# EAGLE design Teensylu2-0.6 (EAGLE 7.1.0)
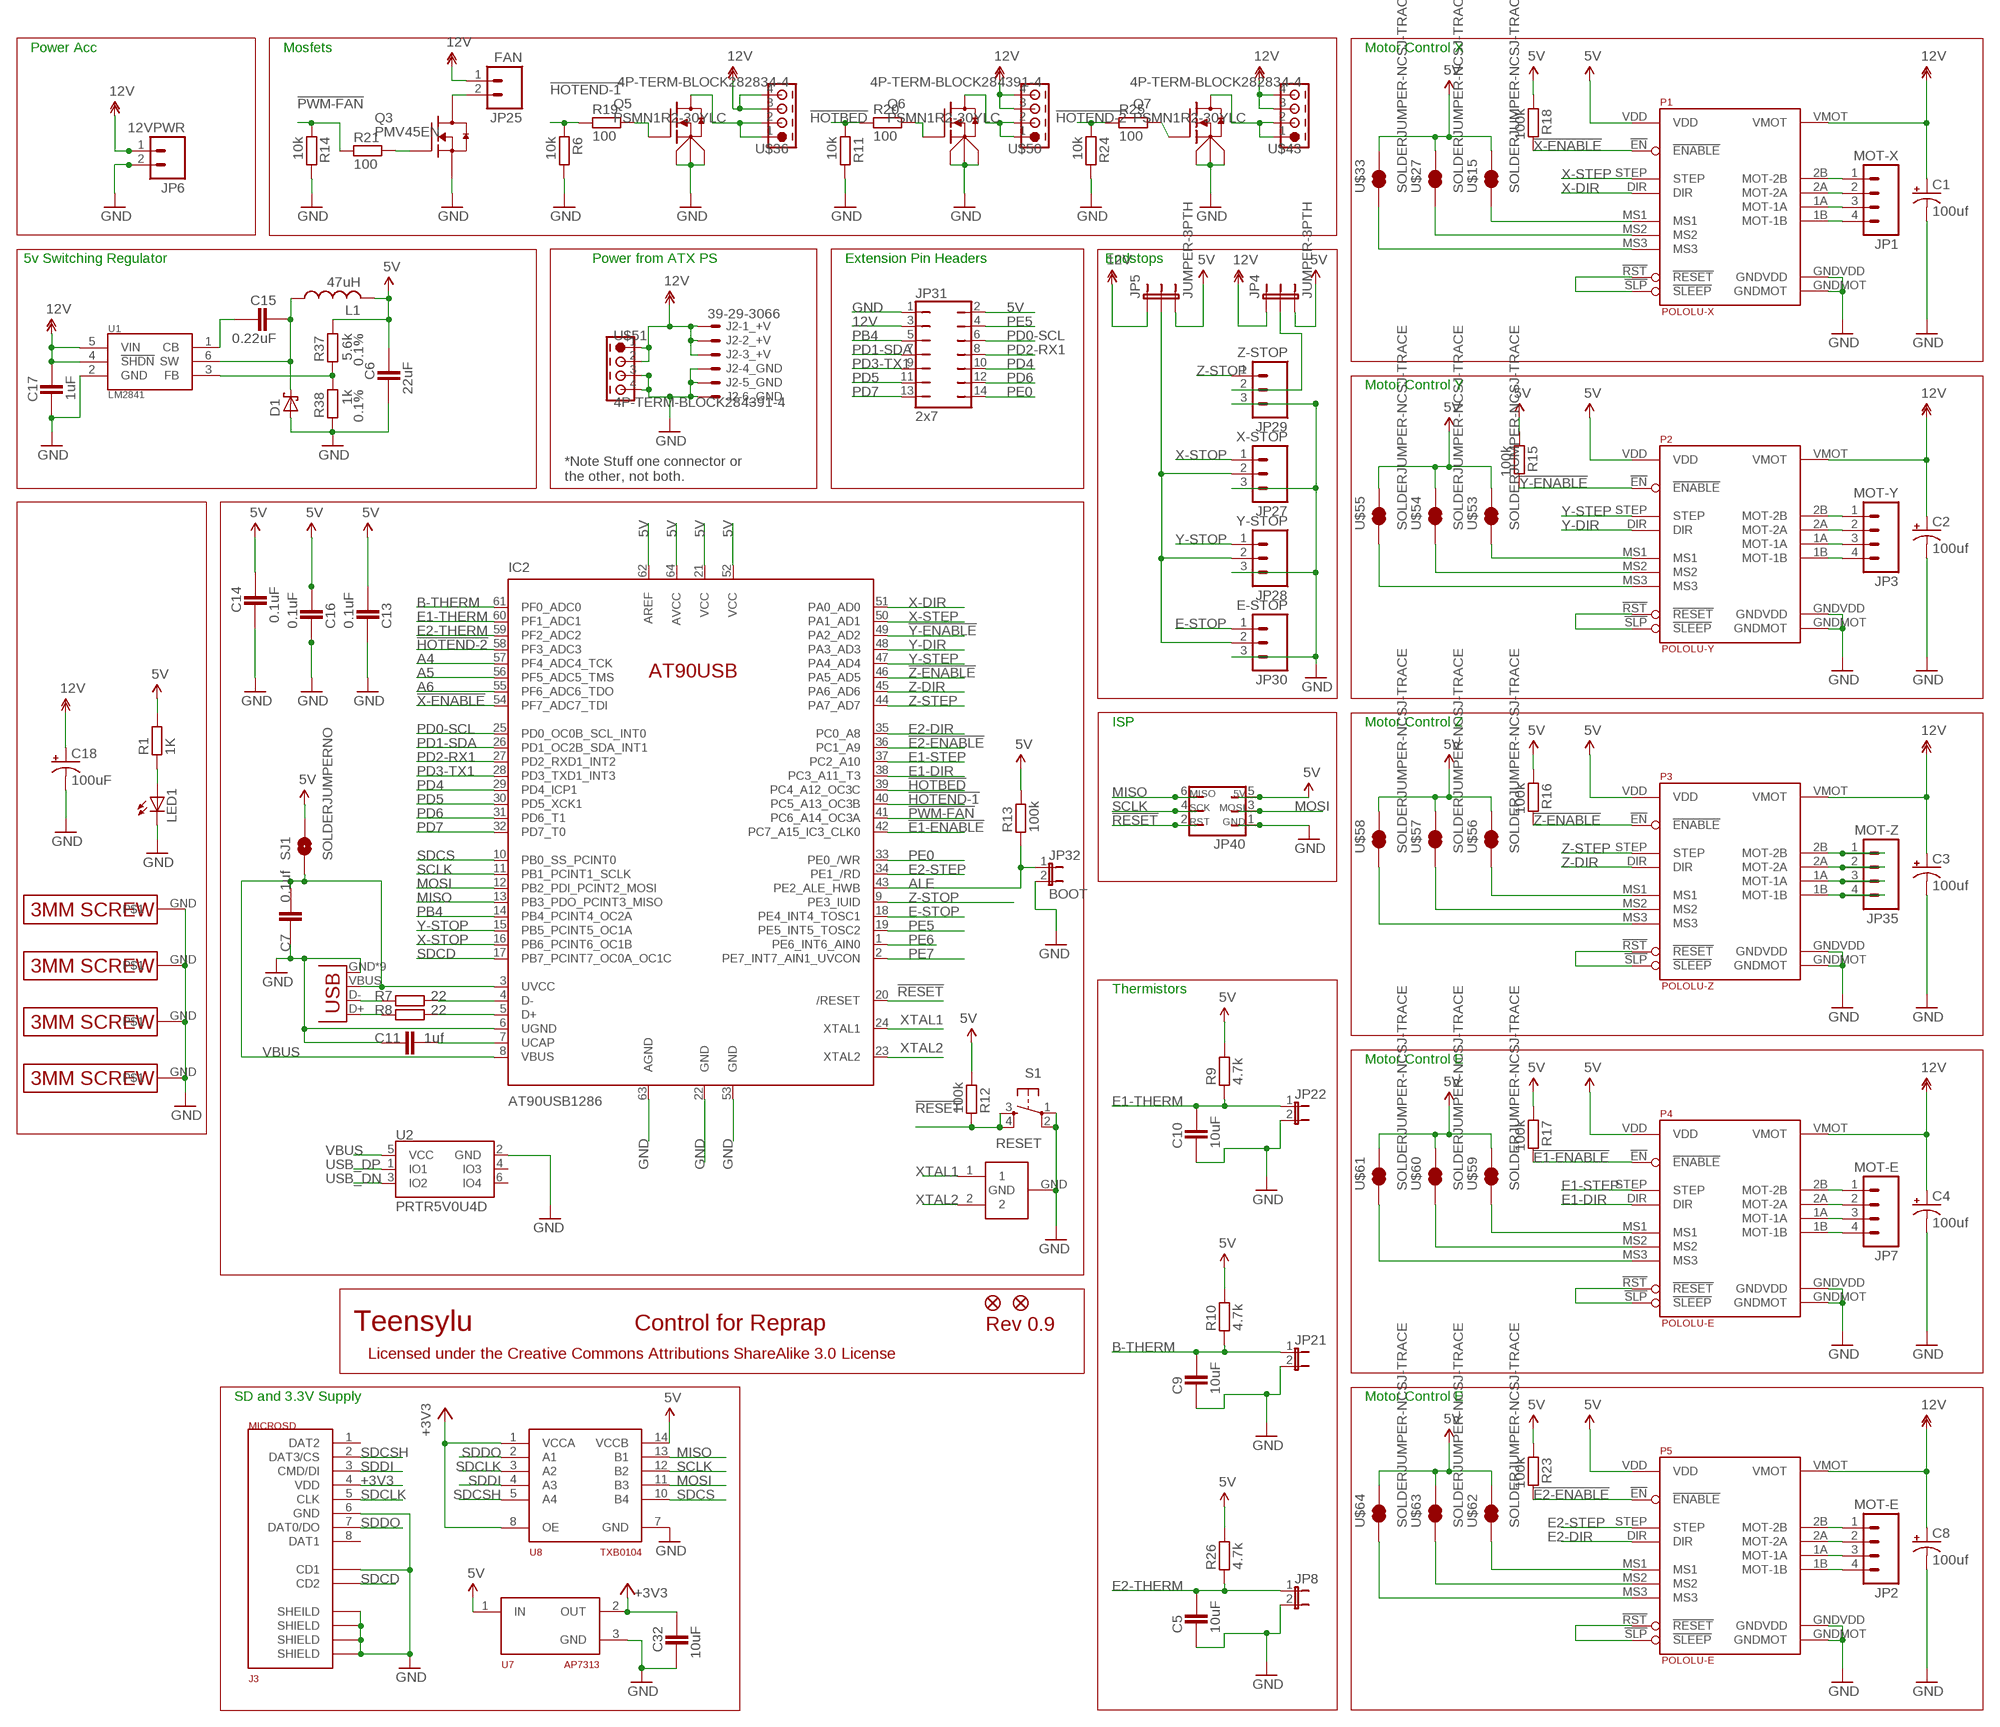
[diagram p0: schematic, sheet 1]

## Parts
C1  100uf  CAP_POLPTH1  [CPOL-RADIAL-100UF-25V]
C2  100uf  CAP_POLPTH1  [CPOL-RADIAL-100UF-25V]
C3  100uf  CAP_POLPTH1  [CPOL-RADIAL-100UF-25V]
C4  100uf  CAP_POLPTH1  [CPOL-RADIAL-100UF-25V]
C5  10uF  CAPACITOR_0603  [CAPC1608X92N]
C6  22uF  CAPACITOR_0805  [CAPC2012X145AN]
C7  0.1uf  CAPACITOR_0603  [CAPC1608X92N]
C8  100uf  CAP_POLPTH1  [CPOL-RADIAL-100UF-25V]
C9  10uF  CAPACITOR_0603  [CAPC1608X92N]
C10  10uF  CAPACITOR_0603  [CAPC1608X92N]
C11  1uf  CAPACITOR_0603  [CAPC1608X92N]
C13  0.1uF  CAPACITOR_0603  [CAPC1608X92N]
C14  0.1uF  CAPACITOR_0603  [CAPC1608X92N]
C15  0.22uF  CAPACITOR_0603  [CAPC1608X92N]
C16  0.1uF  CAPACITOR_0603  [CAPC1608X92N]
C17  1uF  CAPACITOR_0805  [CAPC2012X145AN]
C18  100uF  CPOL-USD  [PANASONIC_D]
C32  10uF  CAPACITOR_0805  [CAPC2012X145AN]
D1  SCH-DIODESMA  [SMA]
IC2  AT90USB1286  AT90USB  [TQFP64-2]
J1  USB-MICRO-PTH  [USB-MICROB-PTH]
J2  39-29-3066  [39-29-3066]
J3  MICROSD  [AMPHENOL-MICROSD]
JP1  MOT-X  M04POLAR  [MOLEX-1X4]
JP2  MOT-E  M04POLAR  [MOLEX-1X4]
JP3  MOT-Y  M04POLAR  [MOLEX-1X4]
JP4  JUMPER-3PTH  [1X03]
JP5  JUMPER-3PTH  [1X03]
JP6  12VPWR  M02POLAR  [MOLEX-1X2]
JP7  MOT-E  M04POLAR  [MOLEX-1X4]
JP8  JUMPER-2PTH  [1X02]
JP21  JUMPER-2PTH  [1X02]
JP22  JUMPER-2PTH  [1X02]
JP25  FAN  M02POLAR  [MOLEX-1X2]
JP26  FIDUCIAL1X2.5  [FIDUCIAL-1X2.5]
JP27  X-STOP  M03POLAR  [MOLEX-1X3]
JP28  Y-STOP  M03POLAR  [MOLEX-1X3]
JP29  Z-STOP  M03POLAR  [MOLEX-1X3]
JP30  E-STOP  M03POLAR  [MOLEX-1X3]
JP31  2x7  JP7Q  [JP7Q]
JP32  BOOT  JUMPER-2PTH  [1X02]
JP33  FIDUCIAL1X2.5  [FIDUCIAL-1X2.5]
JP35  MOT-Z  M04POLAR  [MOLEX-1X4]
JP40  PROGHEADER  [ISP]
L1  47uH  L-US  [SDR1006]
LED1  LEDCHIPLED_0805  [CHIPLED_0805]
P1  POLOLU-X  POLOLU-ALLEGRO  [POLOLU-STEPPER-PTH]
P2  POLOLU-Y  POLOLU-ALLEGRO  [POLOLU-STEPPER-PTH]
P3  POLOLU-Z  POLOLU-ALLEGRO  [POLOLU-STEPPER-PTH]
P4  POLOLU-E  POLOLU-ALLEGRO  [POLOLU-STEPPER-PTH]
P5  POLOLU-E  POLOLU-ALLEGRO  [POLOLU-STEPPER-PTH]
Q3  PMV45EN  MOSFET-NCH_SOT-23  [SOT95P280X135-3N]
Q5  PSMN1R2-30YLC  [LFPACK-POWERPAK-SO8]
Q6  PSMN1R2-30YLC  [LFPACK-POWERPAK-SO8]
Q7  PSMN1R2-30YLC  [LFPACK-POWERPAK-SO8]
R1  1K  RESISTOR_0603  [RESC1608X55N]
R6  10k  RESISTOR_0603  [RESC1608X55N]
R7  22  RESISTOR_0603  [RESC1608X55N]
R8  22  RESISTOR_0603  [RESC1608X55N]
R9  4.7k  RESISTOR_0603  [RESC1608X55N]
R10  4.7k  RESISTOR_0603  [RESC1608X55N]
R11  10k  RESISTOR_0603  [RESC1608X55N]
R12  100k  RESISTOR_0603  [RESC1608X55N]
R13  100k  RESISTOR_0603  [RESC1608X55N]
R14  10k  RESISTOR_0603  [RESC1608X55N]
R15  100k  RESISTOR_0603  [RESC1608X55N]
R16  100k  RESISTOR_0603  [RESC1608X55N]
R17  100k  RESISTOR_0603  [RESC1608X55N]
R18  100k  RESISTOR_0603  [RESC1608X55N]
R19  100  RESISTOR_0603  [RESC1608X55N]
R20  100  RESISTOR_0603  [RESC1608X55N]
R21  100  RESISTOR_0603  [RESC1608X55N]
R23  100k  RESISTOR_0603  [RESC1608X55N]
R24  10k  RESISTOR_0603  [RESC1608X55N]
R25  100  RESISTOR_0603  [RESC1608X55N]
R26  4.7k  RESISTOR_0603  [RESC1608X55N]
R37  5.6k  RESISTOR_0603  [RESC1608X55N]
R38  1k  RESISTOR_0603  [RESC1608X55N]
S1  RESET  TAC_SWITCHPTH  [TACTILE-PTH]
SJ1  SOLDERJUMPERNO  [SJ_2S-NO]
U1  LM2841  [TSOT6]
U2  PRTR5V0U4D  [SOT23-6]
U7  AP7313  [SOT23C]
U8  TXB0104  [TSSOP14]
U$15  SOLDERJUMPER-NCSJ-TRACE  [SJ_2S-TRACE]
U$17  3MM-SCREW  [PLATEDSCREW]
U$24  3MM-SCREW  [PLATEDSCREW]
U$27  SOLDERJUMPER-NCSJ-TRACE  [SJ_2S-TRACE]
U$33  SOLDERJUMPER-NCSJ-TRACE  [SJ_2S-TRACE]
U$34  3MM-SCREW  [PLATEDSCREW]
U$36  4P-TERM-BLOCK282834-4  [282834-4]
U$37  3MM-SCREW  [PLATEDSCREW]
U$43  4P-TERM-BLOCK282834-4  [282834-4]
U$50  4P-TERM-BLOCK284391-4  [284391-4]
U$51  4P-TERM-BLOCK284391-4  [284391-4]
U$53  SOLDERJUMPER-NCSJ-TRACE  [SJ_2S-TRACE]
U$54  SOLDERJUMPER-NCSJ-TRACE  [SJ_2S-TRACE]
U$55  SOLDERJUMPER-NCSJ-TRACE  [SJ_2S-TRACE]
U$56  SOLDERJUMPER-NCSJ-TRACE  [SJ_2S-TRACE]
U$57  SOLDERJUMPER-NCSJ-TRACE  [SJ_2S-TRACE]
U$58  SOLDERJUMPER-NCSJ-TRACE  [SJ_2S-TRACE]
U$59  SOLDERJUMPER-NCSJ-TRACE  [SJ_2S-TRACE]
U$60  SOLDERJUMPER-NCSJ-TRACE  [SJ_2S-TRACE]
U$61  SOLDERJUMPER-NCSJ-TRACE  [SJ_2S-TRACE]
U$62  SOLDERJUMPER-NCSJ-TRACE  [SJ_2S-TRACE]
U$63  SOLDERJUMPER-NCSJ-TRACE  [SJ_2S-TRACE]
U$64  SOLDERJUMPER-NCSJ-TRACE  [SJ_2S-TRACE]
XTAL  KYOCERA_PQRC_TYPE_S_RESONATOR  [AVX_3.2X1.3_RESONATOR]

## Nets
5V [power]: C6.1 C13.2 C14.1 C16.2 IC2.21(VCC) IC2.52(VCC) IC2.62(AREF) IC2.64(AVCC) JP4.3 JP5.3 JP31.2 JP40.5 L1.P$2 P1.VDD P2.VDD P3.VDD P4.VDD P5.VDD R1.2 R9.2 R10.2 R12.2 R13.2 R15.1 R16.1 R17.1 R18.1 R23.1 R26.2 R37.1 SJ1.2 U7.1(IN) U8.14(VCCB) U$15.2 U$27.2 U$33.2 U$53.2 U$54.2 U$55.2 U$56.2 U$57.2 U$58.2 U$59.2 U$60.2 U$61.2 U$62.2 U$63.2 U$64.2
5VREG_CB: C15.2 U1.1(CB)
5VREG_FB: R37.2 R38.1 U1.3(FB)
5VREG_SW: C15.1 D1.C L1.P$1 U1.6(SW)
12V: C1.1(+) C2.1(+) C3.1(+) C4.1(+) C8.1(+) C17.1 C18.+ J2.1 J2.2 J2.3 JP4.1 JP5.1 JP6.1 JP25.1 JP31.3 P1.VMOT P2.VMOT P3.VMOT P4.VMOT P5.VMOT U1.4(!SHDN) U1.5(VIN) U$36.3 U$36.4 U$43.3 U$43.4 U$50.3 U$50.4 U$51.1 U$51.2
!E1-ENABLE: IC2.42(PC7_A15_IC3_CLK0) P4.!EN(!ENABLE) R17.2
!E2-ENABLE: IC2.36(PC1_A9) P5.!EN(!ENABLE) R23.2
!HOTBED: IC2.39(PC4_A12_OC3C) R11.1 R20.1
!HOTEND-1: IC2.40(PC5_A13_OC3B) R6.1 R19.1
!HOTEND-2: IC2.58(PF3_ADC3) R24.1 R25.1
!PWM-FAN: IC2.41(PC6_A14_OC3A) R14.1 R21.1
!RESET: IC2.20(/RESET) JP40.2 R12.1 S1.3 S1.4
!X-ENABLE: IC2.54(PF7_ADC7_TDI) P1.!EN(!ENABLE) R18.2
!Y-ENABLE: IC2.49(PA2_AD2) P2.!EN(!ENABLE) R15.2
!Z-ENABLE: IC2.46(PA5_AD5) P3.!EN(!ENABLE) R16.2
+3V3 [power]: C32.1 J3.4(VDD) U7.2(OUT) U8.1(VCCA) U8.8(OE)
A4: IC2.57(PF4_ADC4_TCK)
A5: IC2.56(PF5_ADC5_TMS)
A6: IC2.55(PF6_ADC6_TDO)
ALE: IC2.43(PE2_ALE_HWB) JP32.1 R13.1
B-THERM: C9.2 IC2.61(PF0_ADC0) JP21.1 R10.1
E1-DIR: IC2.38(PC3_A11_T3) P4.DIR
E1-STEP: IC2.37(PC2_A10) P4.STEP
E1-THERM: C10.2 IC2.60(PF1_ADC1) JP22.1 R9.1
E2-DIR: IC2.35(PC0_A8) P5.DIR
E2-STEP: IC2.34(PE1_/RD) P5.STEP
E2-THERM: C5.2 IC2.59(PF2_ADC2) JP8.1 R26.1
E-MOT-1A [power]: JP7.3 P4.1A(MOT-1A)
E-MOT-1A1 [power]: JP2.3 P5.1A(MOT-1A)
E-MOT-1B [power]: JP7.4 P4.1B(MOT-1B)
E-MOT-1B1 [power]: JP2.4 P5.1B(MOT-1B)
E-MOT-2A [power]: JP7.2 P4.2A(MOT-2A)
E-MOT-2A1 [power]: JP2.2 P5.2A(MOT-2A)
E-MOT-2B [power]: JP7.1 P4.2B(MOT-2B)
E-MOT-2B1 [power]: JP2.1 P5.2B(MOT-2B)
E-MS1: P4.MS1 U$59.1
E-MS2: P4.MS2 U$60.1
E-MS3: P4.MS3 U$61.1
E-MS4: P5.MS1 U$62.1
E-MS5: P5.MS2 U$63.1
E-MS6: P5.MS3 U$64.1
E-RESETSLEEP: P4.!RST(!RESET) P4.!SLP(!SLEEP)
E-RESETSLEEP1: P5.!RST(!RESET) P5.!SLP(!SLEEP)
E-STOP: IC2.18(PE4_INT4_TOSC1) JP30.1
ENDSTOP+V: JP5.2 JP27.2 JP28.2 JP30.2
GND [power]: C1.2(-) C2.2(-) C3.2(-) C4.2(-) C5.1 C6.2 C7.1 C8.2(-) C9.1 C10.1 C11.1 C13.1 C14.2 C16.1 C17.2 C18.- C32.2 D1.A IC2.6(UGND) IC2.22(GND) IC2.53(GND) IC2.63(AGND) J1.GND J1.GND1(GND) J1.GND2(GND) J1.GND3(GND) J1.GND4(GND) J1.GND5(GND) J1.GND6(GND) J1.GND7(GND) J1.GND8(GND) J2.4 J2.5 J2.6 J3.6(GND) J3.C1(SHEILD) J3.C2(SHIELD) J3.C3(SHIELD) J3.C4(SHIELD) J3.CD1 JP6.2 JP8.2 JP21.2 JP22.2 JP27.3 JP28.3 JP29.3 JP30.3 JP31.1 JP32.2 JP40.1 LED1.C P1.GNDMOT P1.GNDVDD P2.GNDMOT P2.GNDVDD P3.GNDMOT P3.GNDVDD P4.GNDMOT P4.GNDVDD P5.GNDMOT P5.GNDVDD Q3.2(S) Q5.1(S1) Q5.2(S2) Q5.3(S3) Q6.1(S1) Q6.2(S2) Q6.3(S3) Q7.1(S1) Q7.2(S2) Q7.3(S3) R6.2 R11.2 R14.2 R24.2 R38.2 S1.1 S1.2 U1.2(GND) U2.2(GND) U7.3(GND) U8.7(GND) U$17.GND U$24.GND U$34.GND U$37.GND U$51.3 U$51.4 XTAL.GND
HOTBED-GND [power]: Q6.5-8(D) U$50.1 U$50.2
HOTEND-GND [power]: Q5.5-8(D) U$36.1 U$36.2
HOTEND-GND1 [power]: Q7.5-8(D) U$43.1 U$43.2
MISO: IC2.13(PB3_PDO_PCINT3_MISO) JP40.6 U8.13(B1)
MOSI: IC2.12(PB2_PDI_PCINT2_MOSI) JP40.3 U8.11(B3)
N$1: LED1.A R1.1
N$2: Q6.4(G) R20.2
N$3: IC2.4(D-) R7.2
N$4: IC2.5(D+) R8.2
N$6: JP25.2 Q3.3(D)
N$10: Q3.1(G) R21.2
N$11: Q5.4(G) R19.2
N$13: Q7.4(G) R25.2
PB4: IC2.14(PB4_PCINT4_OC2A) JP31.5
PD0-SCL: IC2.25(PD0_OC0B_SCL_INT0) JP31.6
PD1-SDA: IC2.26(PD1_OC2B_SDA_INT1) JP31.7
PD2-RX1: IC2.27(PD2_RXD1_INT2) JP31.8
PD3-TX1: IC2.28(PD3_TXD1_INT3) JP31.9
PD4: IC2.29(PD4_ICP1) JP31.10
PD5: IC2.30(PD5_XCK1) JP31.11
PD6: IC2.31(PD6_T1) JP31.12
PD7: IC2.32(PD7_T0) JP31.13
PE0: IC2.33(PE0_/WR) JP31.14
PE5: IC2.19(PE5_INT5_TOSC2) JP31.4
PE6: IC2.1(PE6_INT6_AIN0)
PE7: IC2.2(PE7_INT7_AIN1_UVCON)
SCLK: IC2.11(PB1_PCINT1_SCLK) JP40.4 U8.12(B2)
SDCD: IC2.17(PB7_PCINT7_OC0A_OC1C) J3.CD2
SDCLK: J3.5(CLK) U8.3(A2)
SDCS: IC2.10(PB0_SS_PCINT0) U8.10(B4)
SDCSH: J3.2(DAT3/CS) U8.5(A4)
SDDI: J3.3(CMD/DI) U8.4(A3)
SDDO: J3.7(DAT0/DO) U8.2(A1)
UCAP: C11.2 IC2.7(UCAP)
USB_DN: J1.D- R7.1 U2.3(IO2)
USB_DP: J1.D+ R8.1 U2.1(IO1)
VBUS: C7.2 IC2.3(UVCC) IC2.8(VBUS) J1.VBUS SJ1.1 U2.5(VCC)
X-DIR: IC2.51(PA0_AD0) P1.DIR
X-MOT-1A [power]: JP1.3 P1.1A(MOT-1A)
X-MOT-1B [power]: JP1.4 P1.1B(MOT-1B)
X-MOT-2A [power]: JP1.2 P1.2A(MOT-2A)
X-MOT-2B [power]: JP1.1 P1.2B(MOT-2B)
X-MS1: P1.MS1 U$15.1
X-MS2: P1.MS2 U$27.1
X-MS3: P1.MS3 U$33.1
X-RESETSLEEP: P1.!RST(!RESET) P1.!SLP(!SLEEP)
X-STEP: IC2.50(PA1_AD1) P1.STEP
X-STOP: IC2.16(PB6_PCINT6_OC1B) JP27.1
XTAL1: IC2.24(XTAL1) XTAL.1
XTAL2: IC2.23(XTAL2) XTAL.2
Y-DIR: IC2.48(PA3_AD3) P2.DIR
Y-MOT-1A [power]: JP3.3 P2.1A(MOT-1A)
Y-MOT-1B [power]: JP3.4 P2.1B(MOT-1B)
Y-MOT-2A [power]: JP3.2 P2.2A(MOT-2A)
Y-MOT-2B [power]: JP3.1 P2.2B(MOT-2B)
Y-MS1: P2.MS1 U$53.1
Y-MS2: P2.MS2 U$54.1
Y-MS3: P2.MS3 U$55.1
Y-RESETSLEEP: P2.!RST(!RESET) P2.!SLP(!SLEEP)
Y-STEP: IC2.47(PA4_AD4) P2.STEP
Y-STOP: IC2.15(PB5_PCINT5_OC1A) JP28.1
Z-DIR: IC2.45(PA6_AD6) P3.DIR
Z-MOT-1A [power]: JP35.3 P3.1A(MOT-1A)
Z-MOT-1B [power]: JP35.4 P3.1B(MOT-1B)
Z-MOT-2A [power]: JP35.2 P3.2A(MOT-2A)
Z-MOT-2B [power]: JP35.1 P3.2B(MOT-2B)
Z-MS1: P3.MS1 U$56.1
Z-MS2: P3.MS2 U$57.1
Z-MS3: P3.MS3 U$58.1
Z-RESETSLEEP: P3.!RST(!RESET) P3.!SLP(!SLEEP)
Z-STEP: IC2.44(PA7_AD7) P3.STEP
Z-STOP: IC2.9(PE3_IUID) JP29.1
Z-STOP-SUPPLY: JP4.2 JP29.2
Unconnected: J3.1(DAT2) J3.8(DAT1) U2.4(IO3) U2.6(IO4)

## Notes on the sheet
- Power Acc | Mosfets | Motor Control X
- 5v Switching Regulator | Power from ATX PS | Extension Pin Headers | Endstops
- Motor Control Y
- *Note Stuff one connector or
  the other, not both.
- ISP | Motor Control Z
- Thermistors
- Motor Control E
- Teensylu | Control for Reprap | Rev 0.9
- Licensed under the Creative Commons Attributions ShareAlike 3.0 License
- SD and 3.3V Supply | Motor Control E

## Library data of the parts
C1-C4 C8 = SparkFun:CAP_POL: Capacitor Polarized These are standard SMD and PTH capacitors. Normally 10uF, 47uF, and 100uF in electrolytic and tantalum varieties. Always verify the external diameter of the through hole cap, it varies with capacity, voltage, and manufacturer. The EIA devices should be standard.
C5-C7 C9-C11 C13-C17 C32 = ipc-7351-capacitor:CAPACITOR_
C18 = rcl:CPOL-US: POLARIZED CAPACITOR, American symbol
D1 = printrbot:SCH-DIODE: Schottky Diodes Source: Fairchild .. BAT54.pdf
IC2 = Atmel-at90usb-teensy:AT90USB
J1 = teensylu:USB: USB Connectors USB-B-PTH is fully proven SKU : PRT-00139 USB-miniB is fully proven SKU : PRT-00587 USB-A-PCB is untested. USB-A-H is throughly reviewed, but untested. Spark Fun Electronics SKU : PRT-00437 USB-B-SMT is throughly reviewed, but untested. Needs silkscreen touching up. USB-A-S has not been used/tested USB-MB-H has not been used/tested
J2 = teensylu:39-29-3066: Mini FIT connector 6 pol Without Snap-in peg Source: http://www.molex.com; MPN: 39-29-3066; OC_FARNELL: unknown; OC_NEWARK: 22K8620
J3 = teensylu:MICROSD
JP1-JP3 JP7 JP35 = SparkFun:M04: Header 4 Standard 4-pin 0.1" header. Use with straight break away headers (SKU : PRT-00116), right angle break away headers (PRT-00553), swiss pins (PRT-00743), machine pins (PRT-00117), and female headers (PRT-00115). Molex polarized connector foot print use with SKU : PRT-08231 with associated crimp pins and housings. 1MM SMD Version SKU: PRT-10208
JP4 JP5 = teensylu:JUMPER-3
JP6 JP25 = SparkFun:M02: Header 2 Standard 2-pin 0.1" header. Use with straight break away headers (SKU : PRT-00116), right angle break away headers (PRT-00553), swiss pins (PRT-00743), machine pins (PRT-00117), and female headers (PRT-00115). Molex polarized connector foot print use with SKU : PRT-08233 with associated crimp pins and housings.
JP8 JP21 JP22 JP32 = teensylu:JUMPER-2: Jumper Basic 0.1" spaced jumper. Use with breakaway headers.
JP26 JP33 = SparkFun:FIDUCIAL: Fiducial Alignment Points Various fiducial points for machine vision alignment.
JP27-JP30 = SparkFun:M03: Header 3 Standard 3-pin 0.1" header. Use with straight break away headers (SKU : PRT-00116), right angle break away headers (PRT-00553), swiss pins (PRT-00743), machine pins (PRT-00117), and female headers (PRT-00115). Molex polarized connector foot print use with SKU : PRT-08232 with associated crimp pins and housings.
JP31 = teensylu:JP7Q: JUMPER
JP40 = teensylu:PROGHEADER: JUMPER
L1 = teensylu:L-US
LED1 = led:LED: LED OSRAM: - CHIPLED LG R971, LG N971, LY N971, LG Q971, LY Q971, LO R971, LY R971 LH N974, LH R974 LS Q976, LO Q976, LY Q976 LO Q996 - Hyper CHIPLED LW Q18S LB Q993, LB Q99A, LB R99A - SideLED LS A670, LO A670, LY A670, LG A670, LP A670 LB A673, LV A673, LT A673, LW A673 LH A674 LY A675 LS A676, LA A676, LO A676, LY A676, LW A676 LS A679, LY A679, LG A679 - Hyper Micro SIDELED® LS Y876, LA Y876, LO Y876, LY Y876 LT Y87S - SmartLED LW L88C, LW L88S LB L89C, LB L89S, LG L890 LS L89K, LO L89K, LY L89K LS L896, LA L896, LO L896, LY L896 - TOPLED LS T670, LO T670, LY T670, LG T670, LP T670 LSG T670, LSP T670, LSY T670, LOP T670, LYG T670 LG T671, LOG T671, LSG T671 LB T673, LV T673, LT T673, LW T673 LH T674 LS T676, LA T676, LO T676, LY T676, LB T676, LH T676, LSB T676, LW T676 LB T67C, LV T67C, LT T67C, LS T67K, LO T67K, LY T67K, LW E67C LS E67B, LA E67B, LO E67B, LY E67B, LB E67C, LV E67C, LT E67C LW T67C LS T679, LY T679, LG T679 LS T770, LO T770, LY T770, LG T770, LP T770 LB T773, LV T773, LT T773, LW T773 LH T774 LS E675, LA E675, LY E675, LS T675 LS T776, LA T776, LO T776, LY T776, LB T776 LHGB T686 LT T68C, LB T68C - Hyper Mini TOPLED® LB M676 - Mini TOPLED Santana® LG M470 LS M47K, LO M47K, LY M47K Source: http://www.osram.convergy.de LUXEON: - LUMILED® LXK2-PW12-R00, LXK2-PW12-S00, LXK2-PW14-U00, LXK2-PW14-V00 LXK2-PM12-R00, LXK2-PM12-S00, LXK2-PM14-U00 LXK2-PE12-Q00, LXK2-PE12-R00, LXK2-PE12-S00, LXK2-PE14-T00, LXK2-PE14-U00 LXK2-PB12-K00, LXK2-PB12-L00, LXK2-PB12-M00, LXK2-PB14-N00, LXK2-PB14-P00, LXK2-PB14-Q00 LXK2-PR12-L00, LXK2-PR12-M00, LXK2-PR14-Q00, LXK2-PR14-R00 LXK2-PD12-Q00, LXK2-PD12-R00, LXK2-PD12-S00 LXK2-PH12-R00, LXK2-PH12-S00 LXK2-PL12-P00, LXK2-PL12-Q00, LXK2-PL12-R00 Source: www.luxeon.com KINGBRIGHT: KA-3528ASYC Source: www.kingbright.com
P1-P5 = teensylu:POLOLU-ALLEGRO
Q3 = ipc-7351-transistor:MOSFET-NCH_
Q5-Q7 = teensylu:PSMN1R2-30YLC: N-Channel MOSFET - 30V 100A LFPAK
R1 R6-R21 R23-R26 = ipc-7351-resistor:RESISTOR_
R37 R38 = ipc-7351-resistor:RESISTOR_; TOLERANCE: 0.1%
S1 = SparkFun:TAC_SWITCH: Momentary Switch Button commonly used for reset or general input. Spark Fun Electronics SKU : COM-00097
SJ1 = teensylu:SOLDERJUMPER: Solder Jumper Standard SMD solder jumper. Used to automate production. Two varients : Normally Open and Normally Closed are the same, but have different paste layers. NC will have a large amount of paste and should jumper during reflow.
U1 = teensylu:LM2841
U2 = teensylu:PRTR5V0U4D: NXP Semiconductors PRTR5V0U4D,125
U7 = teensylu:AP7313
U8 = teensylu:TXB0104
U$15 U$27 U$33 U$53-U$64 = teensylu:SOLDERJUMPER-NC
U$17 U$24 U$34 U$37 = teensylu:3MM-SCREW: 3mm Plated Through Hole Screw
U$36 U$43 U$50 U$51 = teensylu:4P-TERM-BLOCK
XTAL = Kyocera_Resonator:KYOCERA_PQRC_TYPE_S_RESONATOR

## Board
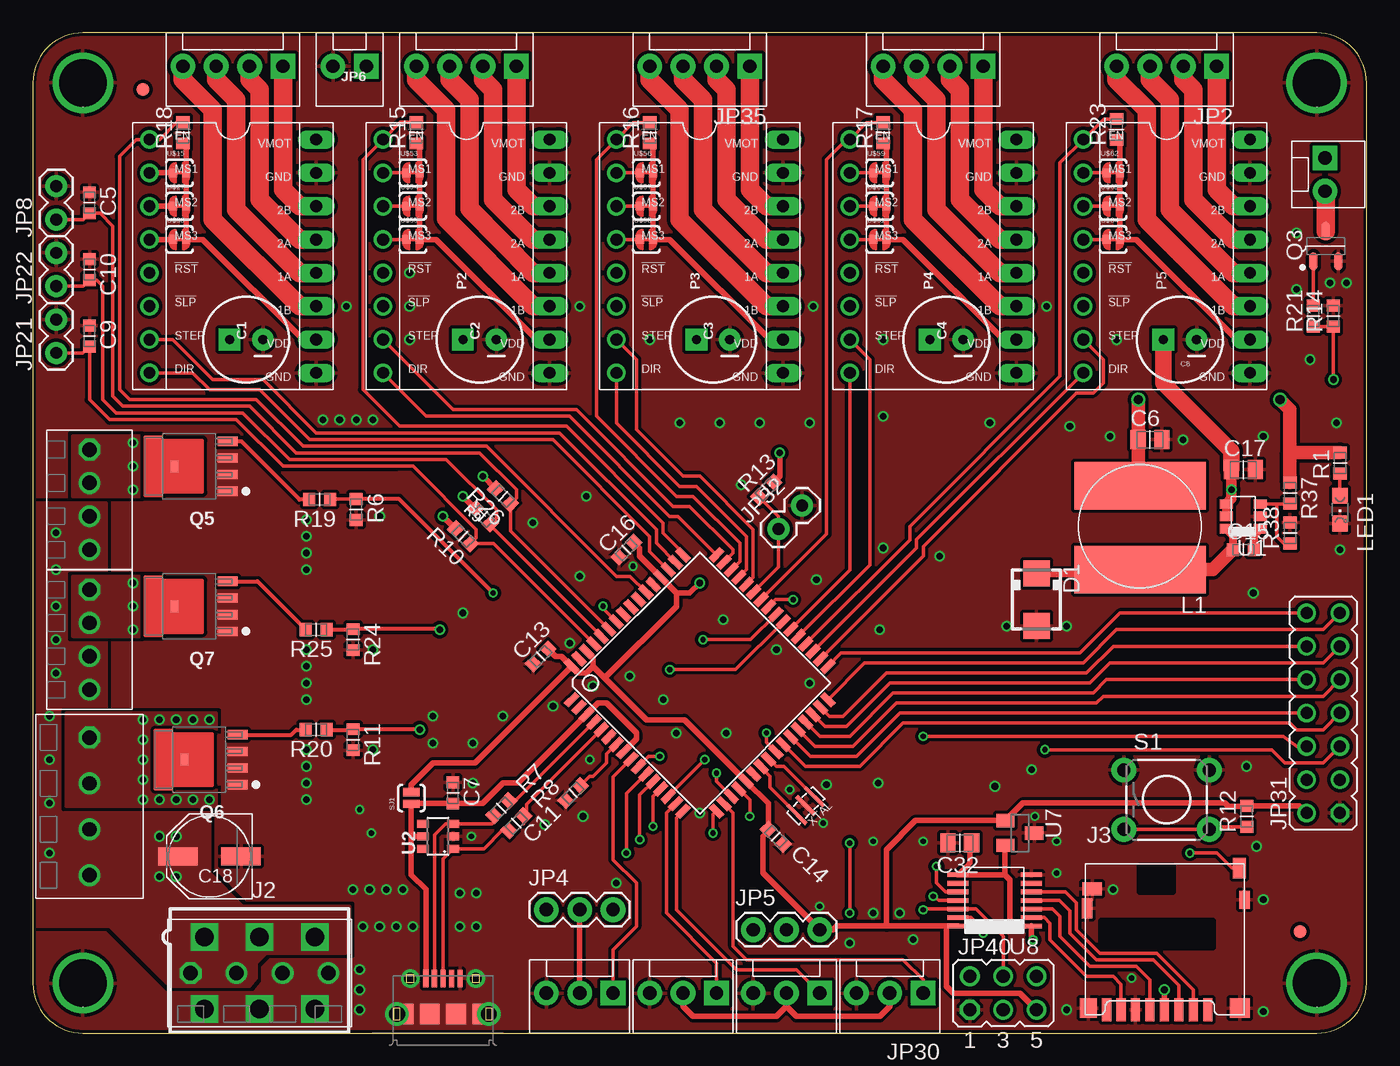
[diagram p1: board, top side]
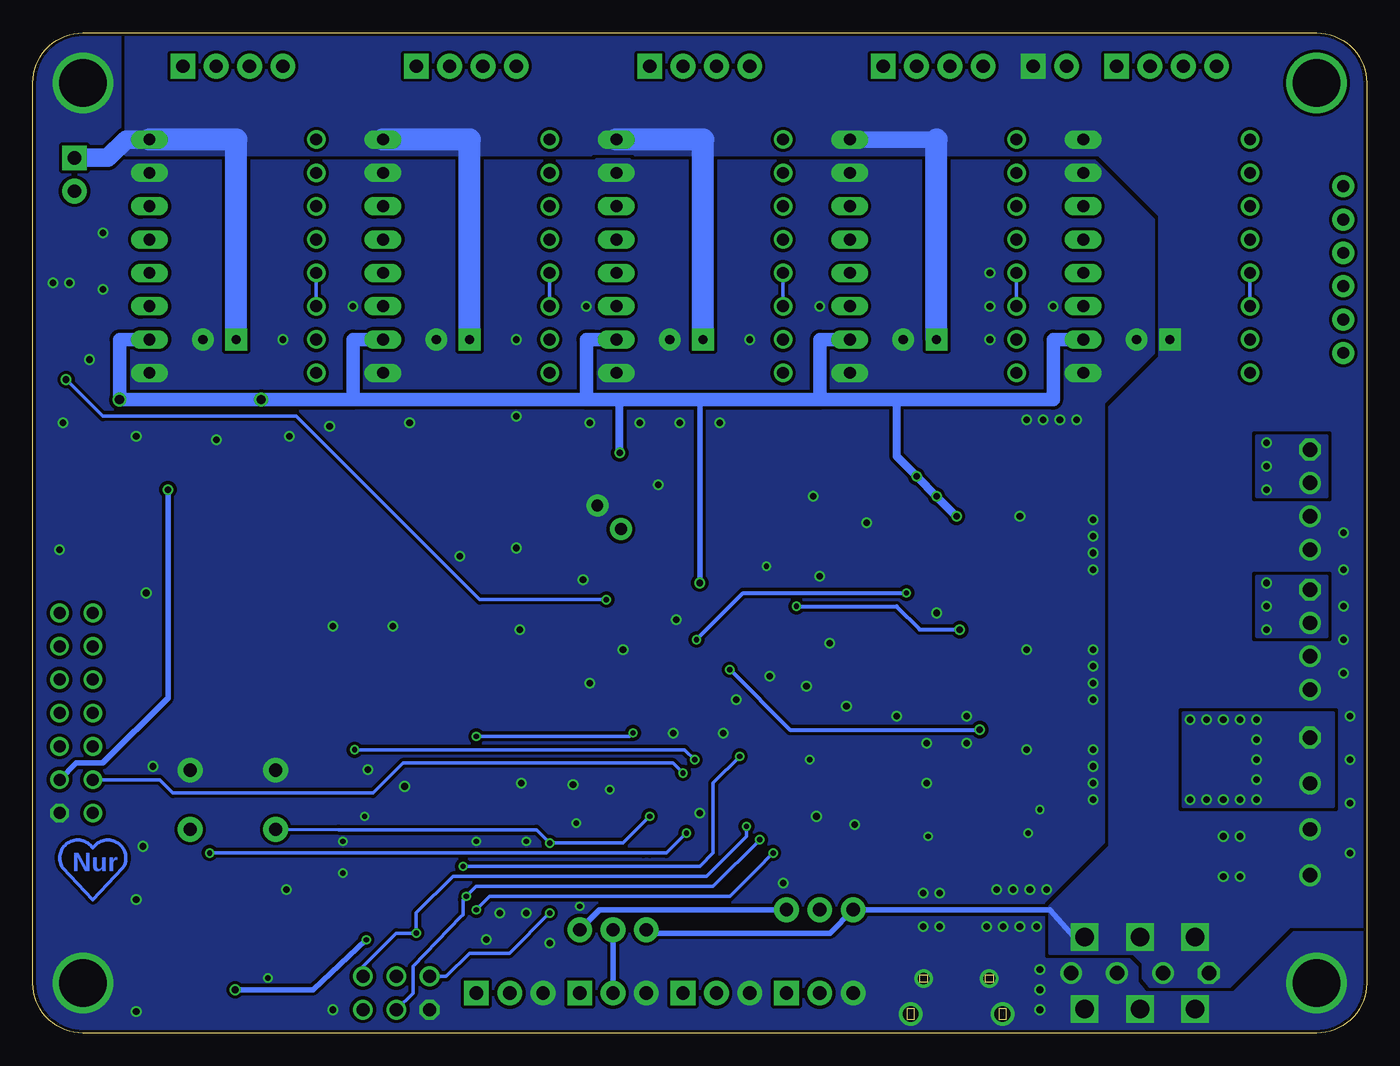
[diagram p2: board, bottom side, seen from below]

Size 101.6 x 76.2 mm. Coordinates in mm from the lower left corner, seen from the top.
Outline: 0,3.81 arc90 3.81,0 97.79,0 arc90 101.6,3.81 101.6,72.39 arc90 97.79,76.2 3.81,76.2 arc90 0,72.39 0,3.81
Copper layers (1*16): Top 0.035mm / dielectric 1.5mm / Bottom 0.035mm
Design rules "Teensylu Custom *": minimum track width 10mil, minimum drill 15mil, track to track 9mil, track to pad 9mil, pad to pad 9mil, via to via 9mil, smd to smd 0mil, copper to edge 10mil, drill to drill 10mil, minimum pad ring 10mil, minimum via ring 6mil, stop-mask expansion 2mil, vias tented up to drill 100mil, thermal gap 10mil

### Footprints (pad centres in the part's own frame; a part is rotated, then mirrored left to right if it is on the bottom)
CPOL-RADIAL-100UF-25V = drill 0.7 pad 1.651 square: 1 1.27,0 | drill 0.7 pad 1.651: 2 -1.27,0
CAPC1608X92N = smd 0.9 x 0.95: 1 -0.8,0; 2 0.8,0
CAPC2012X145AN = smd 1.15 x 1.45: 1 -0.9,0; 2 0.9,0
PANASONIC_D = smd 3 x 1.4: + 2.4,0; - -2.4,0
SMA = smd 2 x 2: A 2,0; C -2,0
TQFP64-2 = smd 1.194 x 0.508: 1 -7.8,6; 2 -7.8,5.2; 3 -7.8,4.4; 4 -7.8,3.6; 5 -7.8,2.8; 6 -7.8,2; 7 -7.8,1.2; 8 -7.8,0.4; 9 -7.8,-0.4; 10 -7.8,-1.2; 11 -7.8,-2; 12 -7.8,-2.8; 13 -7.8,-3.6; 14 -7.8,-4.4; 15 -7.8,-5.2; 16 -7.8,-6; 33 7.8,-6; 34 7.8,-5.2; 35 7.8,-4.4; 36 7.8,-3.6; 37 7.8,-2.8; 38 7.8,-2; 39 7.8,-1.2; 40 7.8,-0.4; 41 7.8,0.4; 42 7.8,1.2; 43 7.8,2; 44 7.8,2.8; 45 7.8,3.6; 46 7.8,4.4; 47 7.8,5.2; 48 7.8,6 | smd 0.508 x 1.194: 17 -6,-7.8; 18 -5.2,-7.8; 19 -4.4,-7.8; 20 -3.6,-7.8; 21 -2.8,-7.8; 22 -2,-7.8; 23 -1.2,-7.8; 24 -0.4,-7.8; 25 0.4,-7.8; 26 1.2,-7.8; 27 2,-7.8; 28 2.8,-7.8; 29 3.6,-7.8; 30 4.4,-7.8; 31 5.2,-7.8; 32 6,-7.8; 49 6,7.8; 50 5.2,7.8; 51 4.4,7.8; 52 3.6,7.8; 53 2.8,7.8; 54 2,7.8; 55 1.2,7.8; 56 0.4,7.8; 57 -0.4,7.8; 58 -1.2,7.8; 59 -2,7.8; 60 -2.8,7.8; 61 -3.6,7.8; 62 -4.4,7.8; 63 -5.2,7.8; 64 -6,7.8
USB-MICROB-PTH = smd 0.4 x 1.35: D+ 0,2.699; D- -0.65,2.699; GND 1.3,2.699; ID 0.65,2.699; VBUS -1.3,2.699 | drill 1.2 pad 1.676: GND1 -3.5,-0.001; GND6 3.5,-0.001 | smd 1.225 x 1.55: GND2 -2.86,-0.001 | smd 1.5 x 1.55: GND3 -1,-0.001; GND4 1,-0.001 | smd 1.2 x 1.55: GND5 2.86,-0.001 | drill 0.9 pad 1.27: GND7 2.5,2.7; GND8 -2.5,2.7
39-29-3066 = drill 1.4 square: 1 4.2,-2.75; 2 0,-2.75; 3 -4.2,-2.75; 4 4.2,2.75; 5 0,2.75; 6 -4.2,2.75
AMPHENOL-MICROSD = smd 0.7 x 1.75: 1 3.636,-5.842; 2 2.536,-5.842; 3 1.436,-5.842; 4 0.336,-5.842; 5 -0.764,-5.842; 6 -1.864,-5.842; 7 -2.964,-5.842; 8 -4.064,-5.842 | smd 1.29 x 1.5: C1 -5.464,-5.717 | smd 1.5 x 1.5: C2 6.086,-5.717 | smd 0.8 x 1.5: C3 -5.539,1.883 | smd 0.8 x 1.4: C4 6.436,2.533 | smd 1.5 x 1: CD1 -5.164,3.383 | smd 1 x 1.55: CD2 6.036,4.958
MOLEX-1X4 = drill 1.016 pad 1.88 square: 1 0,0 | drill 1.016 pad 1.88: 2 2.54,0; 3 5.08,0; 4 7.62,0
1X03 = drill 1.016 pad 1.88: 1 0,0; 2 2.54,0; 3 5.08,0
MOLEX-1X2 = drill 1.016 pad 1.88 square: 1 0,0 | drill 1.016 pad 1.88: 2 2.54,0
1X02 = drill 0.9 pad 1.676: 1 0,0; 2 2.54,0
FIDUCIAL-1X2.5 = smd 1 x 1: 1 0,0
MOLEX-1X3 = drill 1.016 pad 1.88 square: 1 0,0 | drill 1.016 pad 1.88: 2 2.54,0; 3 5.08,0
JP7Q = drill 0.914 octagon: 1 -7.62,-1.27 | drill 0.914: 2 -7.62,1.27; 3 -5.08,-1.27; 4 -5.08,1.27; 5 -2.54,-1.27; 6 -2.54,1.27; 7 0,-1.27; 8 0,1.27; 9 2.54,-1.27; 10 2.54,1.27; 11 5.08,-1.27; 12 5.08,1.27; 13 7.62,-1.27; 14 7.62,1.27
ISP = drill 1 octagon: 1 -2.54,-1.27 | drill 1: 2 -2.54,1.27; 3 0,-1.27; 4 0,1.27; 5 2.54,-1.27; 6 2.54,1.27
SDR1006 = smd 10.008 x 3.607: P$1 0,3.048; P$2 0,-3.353
CHIPLED_0805 = smd 1.2 x 1.2: A 0,-1.05; C 0,1.05
POLOLU-STEPPER-PTH = drill 0.9 long: 1A 6.35,-1.27; 1B 6.35,-3.81; 2A 6.35,1.27; 2B 6.35,3.81; GNDMOT 6.35,6.35; GNDVDD 6.35,-8.89; VDD 6.35,-6.35; VMOT 6.35,8.89 | drill 0.9: !EN -6.35,8.89; !RST -6.35,-1.27; !SLP -6.35,-3.81; DIR -6.35,-8.89; MS1 -6.35,6.35; MS2 -6.35,3.81; MS3 -6.35,1.27; STEP -6.35,-6.35
SOT95P280X135-3N = smd 1.4 x 0.65: 1 -1.15,0.95; 2 -1.15,-0.95; 3 1.15,0
LFPACK-POWERPAK-SO8 = smd 0.7 x 1.5: 1 -1.905,-2.9; 2 -0.635,-2.9; 3 0.635,-2.9; 4 1.905,-2.9 | smd 0.9 x 0.6: 5-8 0,1.15
RESC1608X55N = smd 0.9 x 1: 1 -0.8,0; 2 0.8,0
TACTILE-PTH = drill 1.016 pad 1.88: 1 -3.251,2.261; 2 3.251,2.261; 3 -3.251,-2.261; 4 3.251,-2.261
SJ_2S-NO = smd 0.635 x 1.27: 1 -0.45,0; 2 0.45,0
TSOT6 = smd 0.69 x 1: 1 -0.95,-1.3; 2 0,-1.3; 3 0.95,-1.3; 4 0.95,1.3; 5 0,1.3; 6 -0.95,1.3
SOT23-6 = smd 0.6 x 0.9: 1 -0.95,-1.15; 2 0,-1.15; 3 0.95,-1.15; 4 0.95,1.15; 5 0,1.15; 6 -0.95,1.15
SOT23C = smd 1 x 1.4: 1 -0.95,-1.1; 2 0.95,-1.1; 3 0,1.1
TSSOP14 = smd 0.35 x 1.6: 1 -2,-2.9; 2 -1.35,-2.9; 3 -0.7,-2.9; 4 -0.05,-2.9; 5 0.6,-2.9; 6 1.25,-2.9; 7 1.9,-2.9; 8 1.9,2.7; 9 1.25,2.7; 10 0.6,2.7; 11 -0.05,2.7; 12 -0.7,2.7; 13 -1.35,2.7; 14 -2,2.7
SJ_2S-TRACE = smd 0.635 x 0.635: 1 -0.508,0; 2 0.508,0
PLATEDSCREW = drill 3.6: GND 0,0
282834-4 = drill 1.1 octagon: 1 -3.81,0 | drill 1.1: 2 -1.27,0; 3 1.27,0; 4 3.81,0
284391-4 = drill 1.1 octagon: 1 -5.25,0 | drill 1.1: 2 -1.753,0; 3 1.753,0; 4 5.25,0
AVX_3.2X1.3_RESONATOR = smd 0.3 x 2: 1 -0.95,0; 2 0.95,0; GND 0,0

### Placement (x,y rotation side)
C1  16.26,52.83 180 top
C2  34.04,52.83 180 top
C3  51.82,52.83 180 top
C4  69.6,52.83 180 top
C5  4.32,63.25 270 top
C6  85.09,45.21 0 top
C7  32,18.29 270 top
C8  87.38,52.83 180 top
C9  4.32,53.09 270 top
C10  4.32,58.17 270 top
C11  41.15,18.29 45 top
C13  38.69,28.7 45 top
C14  56.59,14.96 315 top
C15  92.2,36.83 0 top
C16  45.21,36.83 45 top
C17  92.2,42.93 0 top
C18  13.46,13.46 180 top
C32  70.61,14.48 180 top
D1  76.45,33.02 270 top
IC2  50.8,26.67 45 top
J1  31.24,1.46 0 top
J2  17.27,4.57 180 top
J3  85.85,7.62 0 top
JP1  19.05,73.66 180 top
JP2  90.17,73.66 180 top
JP3  36.83,73.66 180 top
JP4  39.12,9.4 0 top
JP5  54.86,7.87 0 top
JP6  25.4,73.66 180 top
JP7  72.39,73.66 180 top
JP8  1.78,61.98 90 top
JP21  1.78,51.82 90 top
JP22  1.78,56.9 90 top
JP25  98.42,66.67 270 top
JP26  8.38,71.88 0 top
JP27  59.94,3.05 180 top
JP28  52.07,3.05 180 top
JP29  44.2,3.05 180 top
JP30  67.82,3.05 180 top
JP31  98.3,24.38 90 top
JP32  56.81,38.39 45 top
JP33  96.52,7.75 0 top
JP35  54.61,73.66 180 top
JP40  73.91,3.05 0 top
L1  84.33,38.35 180 top
LED1  99.57,39.88 180 top
P1  15.24,59.18 0 top
P2  33.02,59.18 0 top
P3  50.8,59.18 0 top
P4  68.58,59.18 0 top
P5  86.36,59.18 0 top
Q3  98.49,59.94 90 top
Q5  11.94,43.18 90 top
Q6  12.7,20.83 90 top
Q7  11.94,32.51 90 top
R1  99.57,43.43 90 top
R6  24.64,39.88 270 top
R7  35.69,17.14 45 top
R8  36.83,16 45 top
R9  34.29,39.37 135 top
R10  32.77,37.85 135 top
R11  24.38,22.35 270 top
R12  92.46,16.51 90 top
R13  55.88,41.4 45 top
R14  99.06,54.61 90 top
R15  29.21,68.58 90 top
R16  46.99,68.58 90 top
R17  64.77,68.58 90 top
R18  11.43,68.58 90 top
R19  21.84,40.64 180 top
R20  21.59,23.11 180 top
R21  97.54,54.61 90 top
R23  82.55,68.83 90 top
R24  24.38,29.97 270 top
R25  21.59,30.73 180 top
R26  35.81,40.89 135 top
R37  95.76,41.15 270 top
R38  95.76,38.1 90 top
S1  86.36,17.78 0 top
SJ1  28.83,17.91 90 top
U1  92.2,39.37 90 top
U2  30.86,14.99 90 top
U7  75.18,15.24 270 top
U8  73.15,10.16 90 top
U$15  11.18,65.53 0 top
U$17  3.81,3.81 0 top
U$24  97.79,72.39 0 top
U$27  11.18,62.99 0 top
U$33  11.18,60.45 0 top
U$34  97.79,3.81 0 top
U$36  4.32,40.64 270 top
U$37  3.81,72.39 0 top
U$43  4.32,29.97 270 top
U$50  4.32,17.27 270 top
U$51  17.27,4.57 0 top
U$53  28.96,65.53 0 top
U$54  28.96,62.99 0 top
U$55  28.96,60.45 0 top
U$56  46.74,65.53 0 top
U$57  46.74,62.99 0 top
U$58  46.74,60.45 0 top
U$59  64.52,65.53 0 top
U$60  64.52,62.99 0 top
U$61  64.52,60.45 0 top
U$62  82.3,65.53 0 top
U$63  82.3,62.99 0 top
U$64  82.3,60.45 0 top
XTAL  58.88,17.32 225 top

### Tracks (layer width: path | path; a pad name or v marks a point on that pad's centre or on a via)
5V  (via drill 0.5, 0.5 pad 0.25, 0.7)
  Top 0.254: R12.2 92.42,17.27
  Top 0.406: P2.VDD 38.35,52.83 30.73,60.45 U$55.2 U$54.2 U$53.2 29.46,67.53 R15.1 | P1.VDD 20.57,52.83 12.95,60.45 U$33.2 U$27.2 U$15.2 11.68,67.53 R18.1 | P3.VDD 56.13,52.83 48.51,60.45 U$58.2 U$57.2 U$56.2 47.24,67.53 R16.1 | P4.VDD 73.91,52.83 66.29,60.45 U$61.2 U$60.2 U$59.2 65.02,67.53 R17.1 | P5.VDD 91.69,52.83 84.07,60.45 U$64.2 U$63.2 U$62.2 82.8,67.78 R23.1 | IC2.64 41.55,27.43 42.16,27.43 42.67,27.94 | U8.14 69.6,8.16 | 69.6,8.16 65.02,8.16 | 65.02,8.16 61.25,8.16 60.96,7.87 JP5.3 55.63,12.19 55.63,14.99 56.02,15.38 C14.1 56.02,17.49 IC2.21 49.63,23.88 46.74,23.88 43.56,27.05 | JP40.5 75.18,3.05 70.1,3.05 69.6,3.56 69.6,8.16 | 65.02,8.16 65.02,13.97 67.24,16.19 U7.1 75.42,17.53 90.81,17.53 91.06,17.27 92.42,17.27 | JP31.2 96.48,17.31 R12.2 | SJ1.2 28.83,18.92 30.48,20.57 33.67,20.57 IC2.64 | R13.2 56.9,42.42 v56.9,44.2 | v50.8,34.29 50.04,33.53 49.03,33.53 | 49.03,33.53 IC2.52 46.23,36.33 46.23,36.95 C16.2 | IC2.62 42.67,28.57 42.67,27.94 | 42.67,27.94 43.56,27.05 | 49.03,33.53 49.02,33.52 49.02,32.51 43.56,27.05 | R26.2 v34.29,42.42 | v34.29,42.42 | R9.2 v32.77,40.89 | v32.77,40.89 | R10.2 v31.24,39.37 | v31.24,39.37 | C13.2 39.81,28.7 40.28,28.7 IC2.64
  Top 0.61: 85.03,41.01 L1.P$2 84.26,41.77 | R26.2
  Top 1.016: 84.26,41.77 C6.1 84.2,45.22 v84.2,48.26 | R37.1 95.76,44.23 | 95.76,44.23 R1.2 | v95,48.26 95.76,47.5 95.76,44.23
  Bottom 0.406: v50.8,34.29 50.8,48.26 | JP4.3 58.42,9.4 JP5.3
  Bottom 0.61: 35.81,48.26 35.81,43.94 v34.29,42.42 v32.77,40.89 v31.24,39.37 | v56.9,44.2 56.9,48.26
  Bottom 1.016: 77.22,48.26 77.22,52.83 P4.VDD | P5.VDD 95,52.83 v95,48.26 v84.2,48.26 77.22,48.26 | P3.VDD 59.44,52.83 59.44,48.26 | 59.44,48.26 77.22,48.26 | 59.44,48.26 56.9,48.26 50.8,48.26 41.66,48.26 | 41.66,48.26 41.66,52.83 P2.VDD | 41.66,48.26 35.81,48.26 23.88,48.26 23.88,52.83 P1.VDD
5VREG_CB
  Top 0.61: U1.1 93,37.92 C15.2
5VREG_FB
  Top 0.254: R37.2 95.73,40.32 94.74,40.32 | 94.74,40.32 U1.3 | R38.1 95.72,37.34 95.25,37.34 94.74,37.85 94.74,40.32
5VREG_SW
  Top 0.61: 85.28,34.36 L1.P$1 84.07,35.02 D1.C | U1.6 91.4,37.92 C15.1
  Top 1.016: C15.1 89.88,35.31 L1.P$1
12V  (via drill 0.5)
  Top 0.61: U1.5 U1.4
  Top 0.813: U1.4 91.3,40.72 v91.3,41.4 C17.1
  Top 1.27: C8.1 86.11,49.53 91.3,44.33 C17.1
  Bottom 0.406: J2.3 22.31,7.32 24.13,9.4 JP4.1 40.89,7.62 54.1,7.62 JP5.1 | JP31.3 98.3,20.57 96.27,20.57 91.3,25.54 v91.3,41.4
  Bottom 1.27: 32.77,68.07 P2.VMOT
  Bottom 1.422: JP25.1 95.89,66.67 94.49,68.07 P5.VMOT
  Bottom 1.676: C2.1 32.77,68.07 | C3.1 50.55,68.07 P3.VMOT | C4.1 68.33,68.07 P4.VMOT | C8.1 86.11,68.07 P5.VMOT
  other vias: 9.65,14.99 9.65,11.94 10.92,11.94 10.92,14.99 1.27,24.13 1.27,17.53 1.27,20.83 1.78,27.43 1.78,29.97 1.78,32.51 1.78,35.31 1.78,38.1 1.27,13.72
  pour Bottom (rank 2, no thermals): -1.27,8.13 24.13,8.13 24.13,9.65 19.56,14.22 19.56,65.66 20.32,66.93 94.49,66.93 94.49,77.98 -1.27,77.98
  pour Bottom (no thermals): 5.84,8.13 10.41,9.65 24.13,9.65 24.13,6.1 17.78,6.1 17.02,5.33 17.02,4.19 16.51,3.56 10.41,3.56
  pour Top (rank 2, no thermals): -0.25,40.39 5.59,40.39 5.59,17.02 13.46,17.02 13.46,12.19 16,9.65 24.13,9.65 24.13,6.1 17.78,6.1 17.02,5.33 17.02,4.19 16.51,3.56 10.41,3.56 5.84,8.13 -0.25,8.13
!E1-ENABLE
  Top 0.254: R17.2 64.77,69.34 63.5,69.34 P4.!EN 61.98,68.07 60.45,66.55 60.45,38.02 IC2.42
!E2-ENABLE
  Top 0.254: R23.2 81.57,69.63 P5.!EN 78.23,66.29 78.23,50.04 66.8,38.61 66.8,37.58 IC2.36
!HOTBED  (via drill 0.4, 0.5)
  Top 0.254: 24.35,23.11 R11.1 | IC2.39 53.51,27.69 v48.51,27.69
  Top 0.305: 29.43,23.15 R11.1 | R20.1 24.35,23.11
  Top 0.406: v29.46,23.11 29.43,23.15
  Bottom 0.305: v48.51,27.69 43.94,23.11 v29.46,23.11
!HOTEND-1  (via drill 0.4)
  Top 0.254: R6.1 22.94,40.68 R19.1 | IC2.40 54.67,29.97 v51.05,29.97
  Top 0.305: v35.05,33.53 27.9,40.68 R6.1
  Bottom 0.305: v51.05,29.97 47.5,33.53 v35.05,33.53
!HOTEND-2  (via drill 0.4 pad 0.25, 0.5 pad 0.25)
  Top 0.254: 24.35,30.73 R24.1 | IC2.58 43.52,32.26 v43.43,32.51
  Top 0.305: 30.95,30.77 R24.1 | R25.1 24.35,30.73
  Top 0.406: v30.99,30.73 30.95,30.77
  Bottom 0.305: v43.43,32.51 35.81,32.51 34.04,30.73 v30.99,30.73
!PWM-FAN  (via drill 0.4, 0.5)
  Top 0.254: 97.54,53.85 R21.1 R14.1 | 99.06,53.85 R14.1 | v99.06,49.78 R14.1 | IC2.41 56.58,33.02 v57.91,33.02
  Bottom 0.254: v57.91,33.02 67.56,33.02 81.53,46.99 96.27,46.99 v99.06,49.78
!RESET  (via drill 0.4)
  Top 0.254: v62.23,9.14 v62.23,14.48 | S1.3 S1.4 89.8,15.71 R12.1 | IC2.20 54.61,17.77 v54.61,16.51
  Bottom 0.254: JP40.2 70.1,4.32 68.33,6.1 65.28,6.1 v62.23,9.14 | S1.3 78.31,15.49 63.25,15.49 v62.23,14.48 56.64,14.48 v54.61,16.51
!X-ENABLE
  Top 0.254: R18.2 11.39,69.34 10.92,69.34 9.65,68.07 P1.!EN 7.87,68.07 6.6,66.8 6.6,49.02 7.37,48.26 17.02,48.26 20.57,44.7 34.58,44.7 44.45,34.8 45.5,34.8 IC2.54
!Y-ENABLE
  Top 0.254: IC2.49 49.53,36.57 48.01,38.09 48.01,38.86 40.64,46.23 27.94,46.23 25.15,49.02 25.15,66.55 P2.!EN 27.98,69.38 R15.2
!Z-ENABLE
  Top 0.254: R16.2 46.99,69.34 45.72,69.34 P3.!EN 42.93,66.55 42.93,46.99 49.02,40.89 50.29,40.89 53.85,37.34 53.85,35.94 IC2.46
+3V3  (via drill 0.4, 0.5)
  Top 0.254: 74.04,14.35 U7.2
  Top 0.406: 74.04,12.06 U8.8 71.21,12.79 71.37,12.95 71.37,14.59 C32.1 | 74.04,12.06 74.05,12.06 74.42,11.68 74.42,8.64 74.93,8.13 75.51,8.13 U8.1 76.05,7.26 v76.2,7.11 | v86.19,3.3 J3.4 | 74.04,12.06 74.04,13.74 U7.2
  Bottom 0.406: v86.19,3.3 80.26,3.3 v76.2,7.11
ALE
  Top 0.254: IC2.43 56.81,35.51 JP32.1 56.81,39.34 R13.1
B-THERM
  Top 0.254: JP21.1 3.81,51.82 4.28,52.29 C9.2 4.32,48.26 5.84,46.74 15.49,46.74 19.05,43.18 27.43,43.18 27.69,43.18 28.96,43.18 33.78,38.35 33.78,37.73 R10.1 35.1,37.28 IC2.61
E1-DIR
  Top 0.254: IC2.38 62.23,35.27 P4.DIR
E1-STEP
  Top 0.254: IC2.37 63.75,35.66 63.75,51.31 P4.STEP
E1-THERM
  Top 0.254: JP22.1 3.85,56.9 C10.2 4.86,57.37 5.33,56.9 5.33,48.26 6.35,47.24 16,47.24 19.56,43.69 29.46,43.69 29.97,43.69 31.5,43.69 35.31,39.88 35.31,39.26 R9.1 34.86,38.66 IC2.60
E2-DIR
  Top 0.254: P5.DIR 67.31,37.59 67.31,36.96 IC2.35
E2-STEP
  Top 0.254: P5.STEP 81.53,51.31 81.53,49.53 80.77,48.77 79.5,48.77 67.82,37.08 67.82,36.33 IC2.34
E2-THERM
  Top 0.254: JP8.1 3.85,61.98 C5.2 5.12,62.45 6.1,61.47 6.1,48.51 6.86,47.75 16.51,47.75 20.07,44.2 32.77,44.2 33.02,44.2 34.04,44.2 36.83,41.4 36.83,40.78 R26.1 36.38,38.26 IC2.59
E-MOT-1A
  Top 1.422: JP7.3 67.31,72.64 68.83,71.12 68.83,62.74 73.66,57.91 P4.1A
E-MOT-1A1
  Top 1.422: JP2.3 85.09,72.64 86.61,71.12 86.61,62.74 91.44,57.91 P5.1A
E-MOT-1B
  Top 1.422: JP7.4 64.77,72.64 67.06,70.36 67.06,61.98 73.66,55.37 P4.1B
E-MOT-1B1
  Top 1.422: JP2.4 82.55,72.64 84.84,70.36 84.84,61.98 91.44,55.37 P5.1B
E-MOT-2A
  Top 1.422: JP7.2 69.85,72.64 70.61,71.88 70.61,63.5 73.66,60.45 P4.2A
E-MOT-2A1
  Top 1.422: JP2.2 87.63,72.64 88.39,71.88 88.39,63.5 91.44,60.45 P5.2A
E-MOT-2B
  Top 1.422: JP7.1 72.39,64.26 73.66,62.99 P4.2B
E-MOT-2B1
  Top 1.422: JP2.1 90.17,64.26 91.44,62.99 P5.2B
E-MS1
  Top 0.254: P4.MS1 U$59.1
E-MS2
  Top 0.254: P4.MS2 U$60.1
E-MS3
  Top 0.254: P4.MS3 U$61.1
E-MS4
  Top 0.254: P5.MS1 U$62.1
E-MS5
  Top 0.254: P5.MS2 U$63.1
E-MS6
  Top 0.254: P5.MS3 U$64.1
E-RESETSLEEP
  Bottom 0.254: P4.!RST P4.!SLP
E-RESETSLEEP1
  Bottom 0.254: P5.!SLP P5.!RST
E-STOP
  Top 0.254: JP30.1 67.82,4.06 66.29,5.59 54.36,5.59 53.34,6.6 53.34,16.78 IC2.18
ENDSTOP+V
  Top 0.406: JP28.2 49.53,2.03 50.29,1.27 56.64,1.27 57.4,2.03 | JP27.2 57.4,2.03 | 57.4,2.03 58.17,1.27 64.52,1.27 65.28,2.03 JP30.2
  Bottom 0.406: JP5.2 JP27.2
GND  (via drill 0.4, 0.5, 0.5 pad 0.25)
  other vias: 33.4,14.99 24.89,4.83 24.89,3.3 24.89,1.78 45.47,27.18 67.82,14.61 64.39,19.05 77.98,12.19 60.2,16 57.66,18.54 50.8,16.76 49.02,22.86 42.67,26.42 48.01,25.4 59.18,26.67 52.58,31.5 41.66,34.8 45.72,35.56 38.1,38.86 64.01,14.61 66.04,9.14 62.23,6.86 67.06,7.11 82.3,10.92 93.73,10.16 93.73,1.65 93.22,14.22 92.46,20.32 76.07,20.07 76.33,16.51 78.74,30.99 64.52,30.73 74.17,30.99 87.63,45.21 82.55,52.83 98.81,57.15 96.27,56.64 96.27,60.96 77.22,55.37 93.73,45.47 99.31,46.48 97.28,51.31 59.44,55.37 41.66,55.37 23.88,55.37 64.77,52.83 46.99,52.83 28.7,55.37 52.32,46.48 59.18,46.48 53.98,41.78 64.77,36.96 55.37,46.48 59.69,34.54 64.77,46.99 72.9,46.48 69.09,36.32 78.99,46.23 82.04,45.47 92.96,33.53 99.57,36.83 41.91,16.51 38.99,15.88 42.42,20.83 32.51,10.67 24.38,10.92 25.65,10.92 26.92,10.92 25.91,21.59 25.91,29.21 26.42,39.37 20.83,39.12 32.77,32 40.89,29.72 33.53,19.05 35.81,24.13 25.15,8.13 26.42,8.13 32.51,8.13 33.78,8.13 33.78,10.67 20.83,21.59 20.83,20.32 20.83,19.05 20.83,29.21 20.83,27.94 20.83,26.67 20.83,37.85 20.83,36.58 20.83,35.31 25.91,46.74 24.64,46.74 23.37,46.74 22.1,46.74 59.94,9.65 64.01,9.14 78.74,1.78 49.28,46.48 42.16,40.89 28.7,57.91 28.7,52.83 100.08,57.15 52.83,22.86 56.64,29.21 44.45,11.43 83.69,4.19 24.89,17.02 77.98,14.61 60.45,18.92 28.19,10.92 27.69,8.13 28.96,8.13 25.78,15.24 30.48,22.1 30.48,24.13 39.62,24.89 33.53,22.1 73.28,18.8 20.83,25.4 20.83,17.78
  pour Top (isolate 0.254, rank 6): -6.35,78.23 106.68,78.23 106.68,-3.05 -6.35,-3.05
  pour Bottom (isolate 0.254, rank 6, no thermals): -5.08,76.96 105.41,76.96 105.41,-1.78 -5.08,-1.78
  pour Bottom (rank 2, no thermals): 24.13,5.59 18.08,5.59 17.53,5.03 17.53,3.94 16.76,3.05 10.41,3.05 10.41,0 24.13,0
  pour Bottom (no thermals): 23.11,66.29 20.57,66.29 16.26,61.98 16.26,51.82 20.07,48.01 23.11,48.01
  pour Bottom (no thermals): 40.89,66.29 38.35,66.29 33.02,60.96 33.02,52.32 35.81,49.53 40.89,49.53
  pour Bottom (no thermals): 58.67,66.55 56.13,66.55 50.8,61.21 50.8,52.58 53.59,49.78 58.67,49.78
HOTBED-GND  (via drill 0.5)
  other vias: 8.38,23.88 9.65,23.88 10.92,23.88 12.19,23.88 13.46,23.88 13.46,17.78 12.19,17.78 10.92,17.78 9.65,17.78 8.38,17.78 8.38,19.3 8.38,20.83 8.38,22.35
  pour Bottom (no thermals): 2.54,24.38 13.97,24.38 13.97,17.27 2.54,17.27
  pour Top (no thermals): 2.54,24.38 13.97,24.38 13.97,17.27 2.54,17.27
HOTEND-GND  (via drill 0.5)
  other vias: 7.62,44.96 7.62,43.18 7.62,41.4
  pour Bottom (no thermals): 3.05,45.47 8.38,45.47 8.38,40.89 3.05,40.89
  pour Top (no thermals): 3.05,45.47 13.21,45.47 13.21,40.89 3.05,40.89
HOTEND-GND1  (via drill 0.5)
  other vias: 7.62,34.29 7.62,32.51 7.62,30.73
  pour Bottom (no thermals): 3.05,34.8 8.38,34.8 8.38,30.23 3.05,30.23
  pour Top (no thermals): 3.05,34.8 13.21,34.8 13.21,30.23 3.05,30.23
MISO  (via drill 0.4)
  Top 0.254: v72.39,7.62 71.88,8.13 71.88,8.38 71.45,8.81 U8.13 | IC2.13 47.24,18.02 v47.24,15.75
  Bottom 0.254: JP40.6 76.45,5.08 73.91,7.62 v72.39,7.62 72.39,9.14 69.6,11.94 50.29,11.94 47.24,14.99 v47.24,15.75
MOSI  (via drill 0.4)
  Top 0.254: v68.58,10.41 69.01,10.11 U8.11 | IC2.12 46.23,18.14 v46.23,14.73
  Bottom 0.254: JP40.3 72.64,3.05 72.64,5.08 68.96,8.89 68.83,9.02 68.83,10.16 v68.58,10.41 67.82,11.18 51.31,11.18 50.8,11.18 49.78,11.18 v46.23,14.73
N$1
  Top 0.254: LED1.A R1.1
N$2
  Top 0.305: Q6.4 19.68,22.73 20.07,23.11 R20.2
N$3
  Top 0.254: R7.2 36.76,17.71 36.83,17.78 36.83,17.79 IC2.4
N$4
  Top 0.254: 37.4,15.96 R8.2 37.59,16.76 37.59,17.42 IC2.5
N$6
  Top 1.422: Q3.3 98.49,64.14 JP25.2
N$8
  Bottom 0.254: 99.31,12.57 arc180 97.03,14.1 arc180 94.74,12.57 97.03,10.16 99.31,12.57
N$10
  Top 0.254: R21.2 Q3.1
N$11
  Top 0.305: R19.2 20.32,40.64 15.88,45.09 Q5.4
N$13
  Top 0.305: Q7.4 17.11,34.42 R25.2
PB4  (via drill 0.4)
  Top 0.254: v77.09,21.59 94.36,21.59 95.38,20.57 98.3,20.57 JP31.5 | IC2.14 v51.18,20.83
  Bottom 0.254: v77.09,21.59 51.94,21.59 v51.18,20.83
PD0-SCL  (via drill 0.4)
  Top 0.254: JP31.6 96.27,21.84 95.25,22.61 v67.82,22.61 | IC2.25 55.88,22.16 v55.88,22.86
  Bottom 0.254: v55.88,22.86 56.13,22.61 v67.82,22.61
PD1-SDA
  Top 0.254: JP31.7 98.3,23.11 96.27,23.11 95.76,23.62 66.29,23.62 62.99,20.32 58.85,20.32 IC2.26
PD2-RX1
  Top 0.254: JP31.8 68.33,24.38 67.31,24.38 66.04,24.38 62.74,21.08 59.22,21.08 IC2.27
PD3-TX1
  Top 0.254: JP31.9 98.3,25.65 81.53,25.65 81.03,25.15 67.56,25.15 67.06,25.15 65.79,25.15 62.48,21.84 59.59,21.84 IC2.28
PD4
  Top 0.254: JP31.10 81.79,26.92 80.77,25.91 67.82,25.91 66.8,25.91 65.53,25.91 62.23,22.61 59.95,22.61 IC2.29
PD5
  Top 0.254: JP31.11 98.3,28.19 82.04,28.19 80.52,26.67 67.06,26.67 66.55,26.67 65.28,26.67 61.98,23.37 60.33,23.37 IC2.30
PD6
  Top 0.254: JP31.12 82.3,29.46 80.26,27.43 67.06,27.43 66.29,27.43 65.02,27.43 61.72,24.13 60.69,24.13 IC2.31
PD7
  Top 0.254: JP31.13 98.3,30.73 82.55,30.73 80.01,28.19 63.35,28.19 IC2.32
PE0
  Top 0.254: JP31.14 82.8,32 79.76,28.96 61.57,28.96 IC2.33
PE5  (via drill 0.4)
  Top 0.254: IC2.19 52.07,19.18 v52.07,19.81
  Bottom 0.254: JP31.4 91.95,19.3 90.93,18.29 75.69,18.29 73.41,20.57 52.83,20.57 v52.07,19.81
SCLK  (via drill 0.4)
  Top 0.254: JP40.4 73.91,7.37 71.82,9.46 U8.12 67.88,9.46 v67.82,9.4 | IC2.11 45.21,18.25 v45.21,13.72
  Bottom 0.254: v67.82,9.4 66.8,10.41 48.51,10.41 46.86,12.06 46.48,12.45 v45.21,13.72
SDCD  (via drill 0.4)
  Top 0.254: v88.14,13.72 90.17,13.72 91.31,12.58 J3.CD2 | IC2.17 51.82,16.66 v51.82,15.24
  Bottom 0.254: v88.14,13.72 55.12,13.72 54.61,13.72 53.34,13.72 v51.82,15.24
SDCLK
  Top 0.254: U8.3 77.66,9.46 78.23,8.89 78.23,7.37 80.52,5.08 84.07,5.08 85.09,4.06 J3.5
  Top 0.305: J3.5
SDCS  (via drill 0.4)
  Top 0.254: U8.10 69.5,10.76 68.83,11.43 v68.83,12.7 | IC2.10 46.91,21.08 v47.75,21.08
  Bottom 0.254: v47.75,21.08 49.78,19.05 49.78,13.72 50.8,12.7 v68.83,12.7
SDCSH
  Top 0.254: U8.5 78.65,10.76 79.5,9.91 79.5,7.87 81.28,6.1 85.6,6.1 88.39,3.3 J3.2
SDDI
  Top 0.254: U8.4 78.19,10.11 78.99,9.31 78.99,7.62 81.03,5.59 85.34,5.59 87.29,3.64 J3.3
SDDO
  Top 0.254: U8.2 77.04,8.81 77.47,8.38 77.47,7.11 80.26,4.32 82.3,4.32 82.89,3.73 J3.7
UCAP
  Top 0.254: C11.2 42.42,19.56 42.67,19.56 43.69,20.57 43.69,21.25 IC2.7
USB_DN
  Top 0.254: J1.D- 30.59,5.07 30.61,5.21 30.61,15.11 31.43,15.94 U2.3 34.99,15.94 35.12,16.07 R7.1
USB_DP
  Top 0.254: J1.D+ 31.24,13.27 U2.1 34.36,14.04 35.76,15.44 R8.1
VBUS
  Top 0.406: J1.VBUS 29.94,10.95 28.83,12.06 28.83,14.99 | U2.5 28.83,14.99 | 28.83,14.99 SJ1.1 28.86,17.49 C7.2 34.25,17.49 35.81,19.05 36.96,19.05 IC2.3 43.05,25.15 43.69,25.15 45.97,22.86 45.97,22.41 IC2.8
X-DIR
  Top 0.254: P1.DIR 12.19,50.29 13.46,49.02 17.27,49.02 21.08,45.21 39.62,45.21 46.99,37.85 46.99,36.7 IC2.51
X-MOT-1A
  Top 1.422: P1.1A 20.32,57.91 15.49,62.74 15.49,71.12 13.97,72.64 JP1.3
X-MOT-1B
  Top 1.422: P1.1B 20.32,55.37 13.72,61.98 13.72,70.36 11.43,72.64 JP1.4
X-MOT-2A
  Top 1.422: P1.2A 20.32,60.45 17.27,63.5 17.27,71.88 16.51,72.64 JP1.2
X-MOT-2B
  Top 1.422: P1.2B 20.32,62.99 19.05,64.26 JP1.1
X-MS1
  Top 0.406: U$15.1 P1.MS1
X-MS2
  Top 0.406: U$27.1 P1.MS2
X-MS3
  Top 0.406: U$33.1 P1.MS3
X-RESETSLEEP
  Bottom 0.254: P1.!RST P1.!SLP
X-STEP
  Top 0.254: P1.STEP 10.67,52.83 13.72,49.78 17.53,49.78 21.59,45.72 40.13,45.72 47.5,38.35 47.5,37.33 IC2.50
X-STOP
  Top 0.254: JP27.1 58.17,4.83 53.59,4.83 49.02,9.4 49.02,16.41 IC2.16
XTAL1
  Top 0.254: IC2.24 56.09,20.87 56.64,20.32 57.22,20.32 XTAL.1
XTAL2
  Top 0.254: IC2.23 55.47,20.23 56.13,19.56 56.13,18.72 XTAL.2
Y-DIR
  Top 0.254: P2.DIR 29.97,46.99 40.89,46.99 48.51,39.37 49.13,39.37 IC2.48
Y-MOT-1A
  Top 1.422: P2.1A 38.1,57.91 33.27,62.81 33.27,71.12 31.75,72.64 JP3.3
Y-MOT-1B
  Top 1.422: P2.1B 38.1,55.37 31.5,62.06 31.5,70.36 29.21,72.64 JP3.4
Y-MOT-2A
  Top 1.422: P2.2A 38.1,60.45 35.05,63.5 35.05,71.88 34.29,72.64 JP3.2
Y-MOT-2B
  Top 1.422: P2.2B 38.1,62.99 36.83,64.26 JP3.1
Y-MS1
  Top 0.254: P2.MS1 U$53.1
Y-MS2
  Top 0.254: P2.MS2 U$54.1
Y-MS3
  Top 0.254: P2.MS3 U$55.1
Y-RESETSLEEP
  Bottom 0.254: P2.!RST P2.!SLP
Y-STEP
  Top 0.254: P2.STEP 32,47.5 41.4,47.5 48.77,40.13 49.02,40.13 49.53,40.13 50.04,40.13 53.34,36.83 53.34,36.56 IC2.47
Y-STOP
  Top 0.254: JP28.1 52.07,5.33 48.26,9.14 48.26,16.78 IC2.15
Z-DIR
  Top 0.254: P3.DIR 44.45,46.48 49.28,41.66 50.55,41.66 53.59,38.61 54.1,38.1 54.36,37.85 54.36,35.32 IC2.45
Z-MOT-1A
  Top 1.422: P3.1A 55.88,57.91 51.05,62.74 51.05,71.12 49.53,72.64 JP35.3
Z-MOT-1B
  Top 1.422: P3.1B 55.88,55.37 49.28,61.98 49.28,70.36 46.99,72.64 JP35.4
Z-MOT-2A
  Top 1.422: P3.2A 55.88,60.45 52.83,63.5 52.83,71.88 52.07,72.64 JP35.2
Z-MOT-2B
  Top 1.422: P3.2B 55.88,62.99 54.61,64.26 JP35.1
Z-MS1
  Top 0.254: P3.MS1 U$56.1
Z-MS2
  Top 0.254: P3.MS2 U$57.1
Z-MS3
  Top 0.254: P3.MS3 U$58.1
Z-RESETSLEEP
  Bottom 0.254: P3.!RST P3.!SLP
Z-STEP
  Top 0.254: P3.STEP 45.97,51.31 45.97,45.97 49.53,42.42 50.8,42.42 54.86,38.35 54.86,34.69 IC2.44
Z-STOP
  Top 0.254: JP29.1 44.2,6.35 45.97,8.13 45.97,11.43 44.2,13.21 44.2,19.5 IC2.9
Z-STOP-SUPPLY
  Top 0.406: JP4.2 JP29.2

### Text on the board
Bottom: Nur
_tsilk: C1 | C2 | C3 | C4 | MS1 | MS2 | MS3 | MS1 | MS2 | MS3 | MS1 | MS2 | MS3 | MS1 | MS2 | MS3 | R2 | R3 | R4 | R5 | X-MOTOR | Y-MOTOR | Z-MOTOR | 12V PWR | E-MOTOR | 2B | 2A | 1A | 1B | 2B | 2A | 1A | 1B | 2B | 2A | 1A | 1B | GND | +12V | 2B | 2A | 1A | 1B | FAN | Q3 | Extruder | +12V | Therm. | Hot End | R14 | X-Axis | Y-Axis | Z-Axis | Extruder | -V | R21 | R16 | - | + | C10 | R9 | R13 | R1 | ATX+4 | +12V | C13 | C16 | BOOT | R19 | R6 | R17 | POWER LED | Q1 | 12V | R20 | R11 | 12V | GND | Bed | C12 | R15 | C7 | -V | R10 | GND | R18 | SCREW | +12V | C9 | R7 | RESET | C11 | Q2 | R12 | Therm. | Hot Bed | R8 | Endstop Voltage | S1 | 12V | 5V | C14 | Teensylu | ver 0.9 | reprap.org/wiki/Teensylu | E-STOP | GND | +V | SIG | X-STOP | GND | +V | SIG | Y-STOP | GND | +V | SIG | Z-STOP | GND | +V | SIG | 12V | 5V | D12 | PWM | D11 | TX1 | D10 | RX1 | D17 | SDA | D16 | SCL | !RESET | SCK | MISO | ISP/SPI | GND | GND | A4 | A3 | A2 | A1 | A0 | GND | MOSI | 5V